# EAGLE design uTrakHF (EAGLE 7.7.0)
uTrak Balloon Tracker Version 1.0

## Sheet 1 of 2
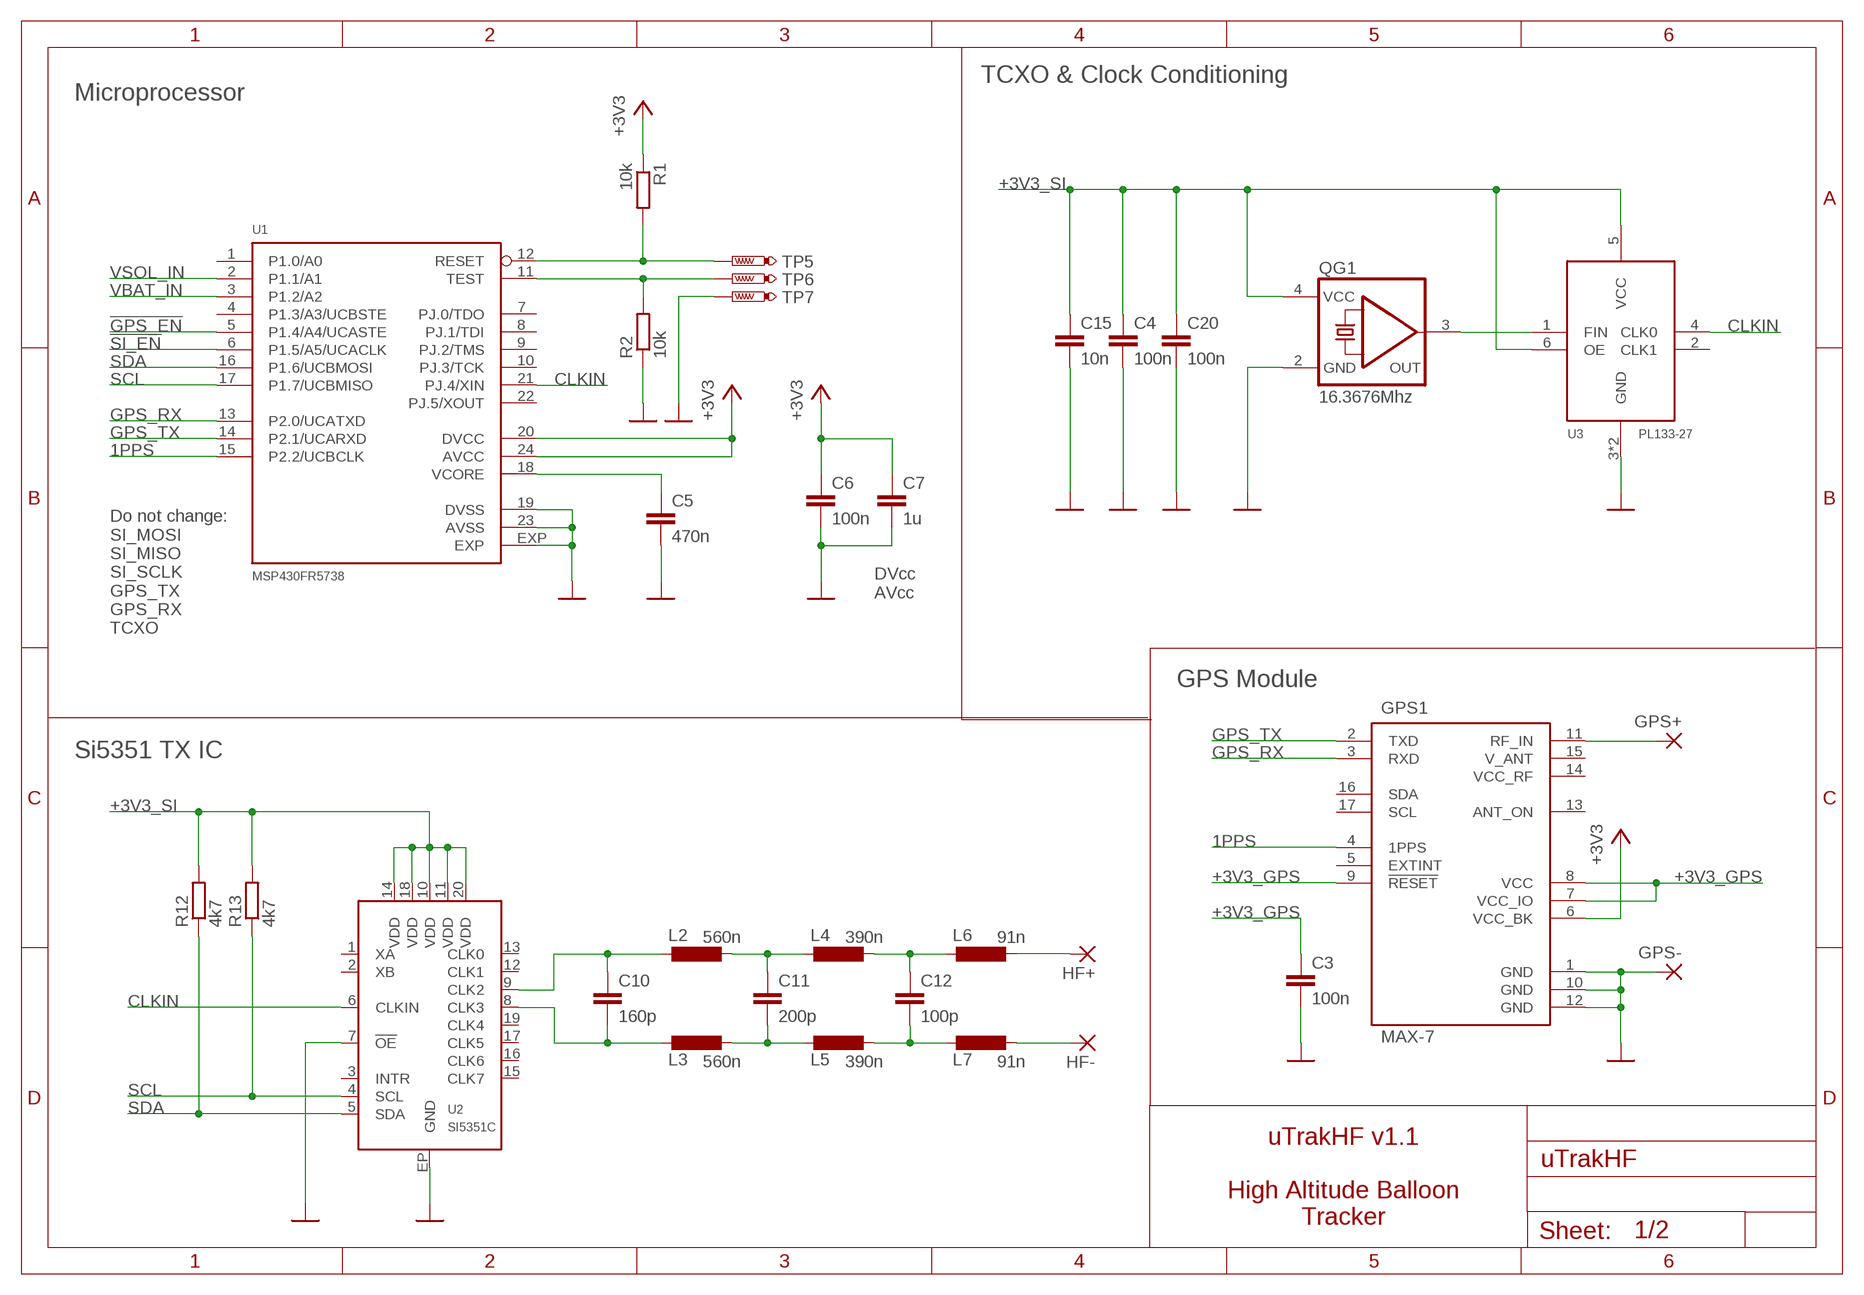
[diagram p0: schematic, sheet 1]

### Parts
C3  100n  C-EUC0402  [C0402]
C4  100n  C-EUC0402  [C0402]
C5  470n  C-EUC0603  [C0603]
C6  100n  C-EUC0402  [C0402]
C7  1u  C-EUC0603  [C0603]
C10  160p  C-EUC0402  [C0402]
C11  200p  C-EUC0402  [C0402]
C12  100p  C-EUC0402  [C0402]
C15  10n  C-EUC0402  [C0402]
C20  100n  C-EUC0402  [C0402]
GPS1  MAX-7  [UBLOX-7]
GPS+  SMD2  [SMD1,27-2,54]
GPS-  SMD2  [SMD1,27-2,54]
HF+  SMD2  [SMD1,27-2,54]
HF-  SMD2  [SMD1,27-2,54]
L2  560n  L0603  [C0603]
L3  560n  L0603  [C0603]
L4  390n  L0603  [C0603]
L5  390n  L0603  [C0603]
L6  91n  L0603  [C0603]
L7  91n  L0603  [C0603]
QG1  16.3676Mhz  XO  [CTS406]
R1  10k  R-EU_R0402  [R0402]
R2  10k  R-EU_R0402  [R0402]
R12  4k7  R-EU_R0402  [R0402]
R13  4k7  R-EU_R0402  [R0402]
TP5  PTR1TP10SQ  [TP10SQ]
TP6  PTR1TP10SQ  [TP10SQ]
TP7  PTR1TP10SQ  [TP10SQ]
U1  MSP430FR5738  [QFN24-4X4]
U2  SI5351C  [QFN20-4X4]
U3  PL133-27  [DFN6-2X3]

### Nets
1PPS: GPS1.4(1PPS) U1.15(P2.2/UCBCLK)
!GPS_EN: U1.5(P1.4/A4/UCASTE) ; also sheet 2
!SI_EN: U1.6(P1.5/A5/UCACLK) ; also sheet 2
+3V3: C6.1 C7.1 GPS1.6(VCC_BK) R1.1 U1.20(DVCC) U1.24(AVCC) ; also sheet 2
+3V3_GPS: C3.1 GPS1.7(VCC_IO) GPS1.8(VCC) GPS1.9(!RESET) ; also sheet 2
+3V3_SI: C4.1 C15.1 C20.1 QG1.4(VCC) R12.2 R13.2 U2.10(VDD) U2.11(VDD) U2.14(VDD) U2.18(VDD) U2.20(VDD) U3.5(VCC) U3.6(OE) ; also sheet 2
C33: C10.1 L2.1 U2.9(CLK2)
CLKIN: U1.21(PJ.4/XIN) U2.6(CLKIN) U3.4(CLK0)
GND: C3.2 C4.2 C5.2 C6.2 C7.2 C15.2 C20.2 GPS1.1(GND) GPS1.10(GND) GPS1.12(GND) GPS-.1(P) QG1.2(GND) R2.1 TP7.TP U1.19(DVSS) U1.23(AVSS) U1.EXP U2.7(!OE) U2.EP(GND) U3.3(GND) U3.EXP(GND) ; also sheet 2
GPS+: GPS1.11(RF_IN) GPS+.1(P)
GPS_RX: GPS1.3(RXD) U1.13(P2.0/UCATXD)
GPS_TX: GPS1.2(TXD) U1.14(P2.1/UCARXD)
HF+: HF+.1(P) L6.2
HF-: HF-.1(P) L7.2
N$2: C5.1 U1.18(VCORE)
N$3: C11.1 L2.2 L4.1
N$5: C12.1 L4.2 L6.1
N$12: C10.2 L3.1 U2.8(CLK3)
N$15: C11.2 L3.2 L5.1
N$16: C12.2 L5.2 L7.1
RST: R1.2 TP5.TP U1.12(RESET)
SCL: R13.1 U1.17(P1.7/UCBMISO) U2.4(SCL)
SDA: R12.1 U1.16(P1.6/UCBMOSI) U2.5(SDA)
TCXO: QG1.3(OUT) U3.1(FIN)
TST: R2.2 TP6.TP U1.11(TEST)
VBAT_IN: U1.3(P1.2/A2) ; also sheet 2
VSOL_IN: U1.2(P1.1/A1) ; also sheet 2
Unconnected: GPS1.5(EXTINT) GPS1.13(ANT_ON) GPS1.14(VCC_RF) GPS1.15(V_ANT) GPS1.16(SDA) GPS1.17(SCL) U1.1(P1.0/A0) U1.4(P1.3/A3/UCBSTE) U1.7(PJ.0/TDO) U1.8(PJ.1/TDI) U1.9(PJ.2/TMS) U1.10(PJ.3/TCK) U1.22(PJ.5/XOUT) U2.1(XA) U2.2(XB) U2.3(INTR) U2.12(CLK1) U2.13(CLK0) U2.15(CLK7) U2.16(CLK6) U2.17(CLK5) U2.19(CLK4) U3.2(CLK1)

### Notes on the sheet
- TCXO & Clock Conditioning
- Microprocessor
- DVcc
  AVcc
- Do not change:
  SI_MOSI
  SI_MISO
  SI_SCLK
  GPS_TX
  GPS_RX
  TCXO
- GPS Module
- Si5351 TX IC
- uTrakHF v1.1
  
  High Altitude Balloon
  Tracker

## Sheet 2 of 2
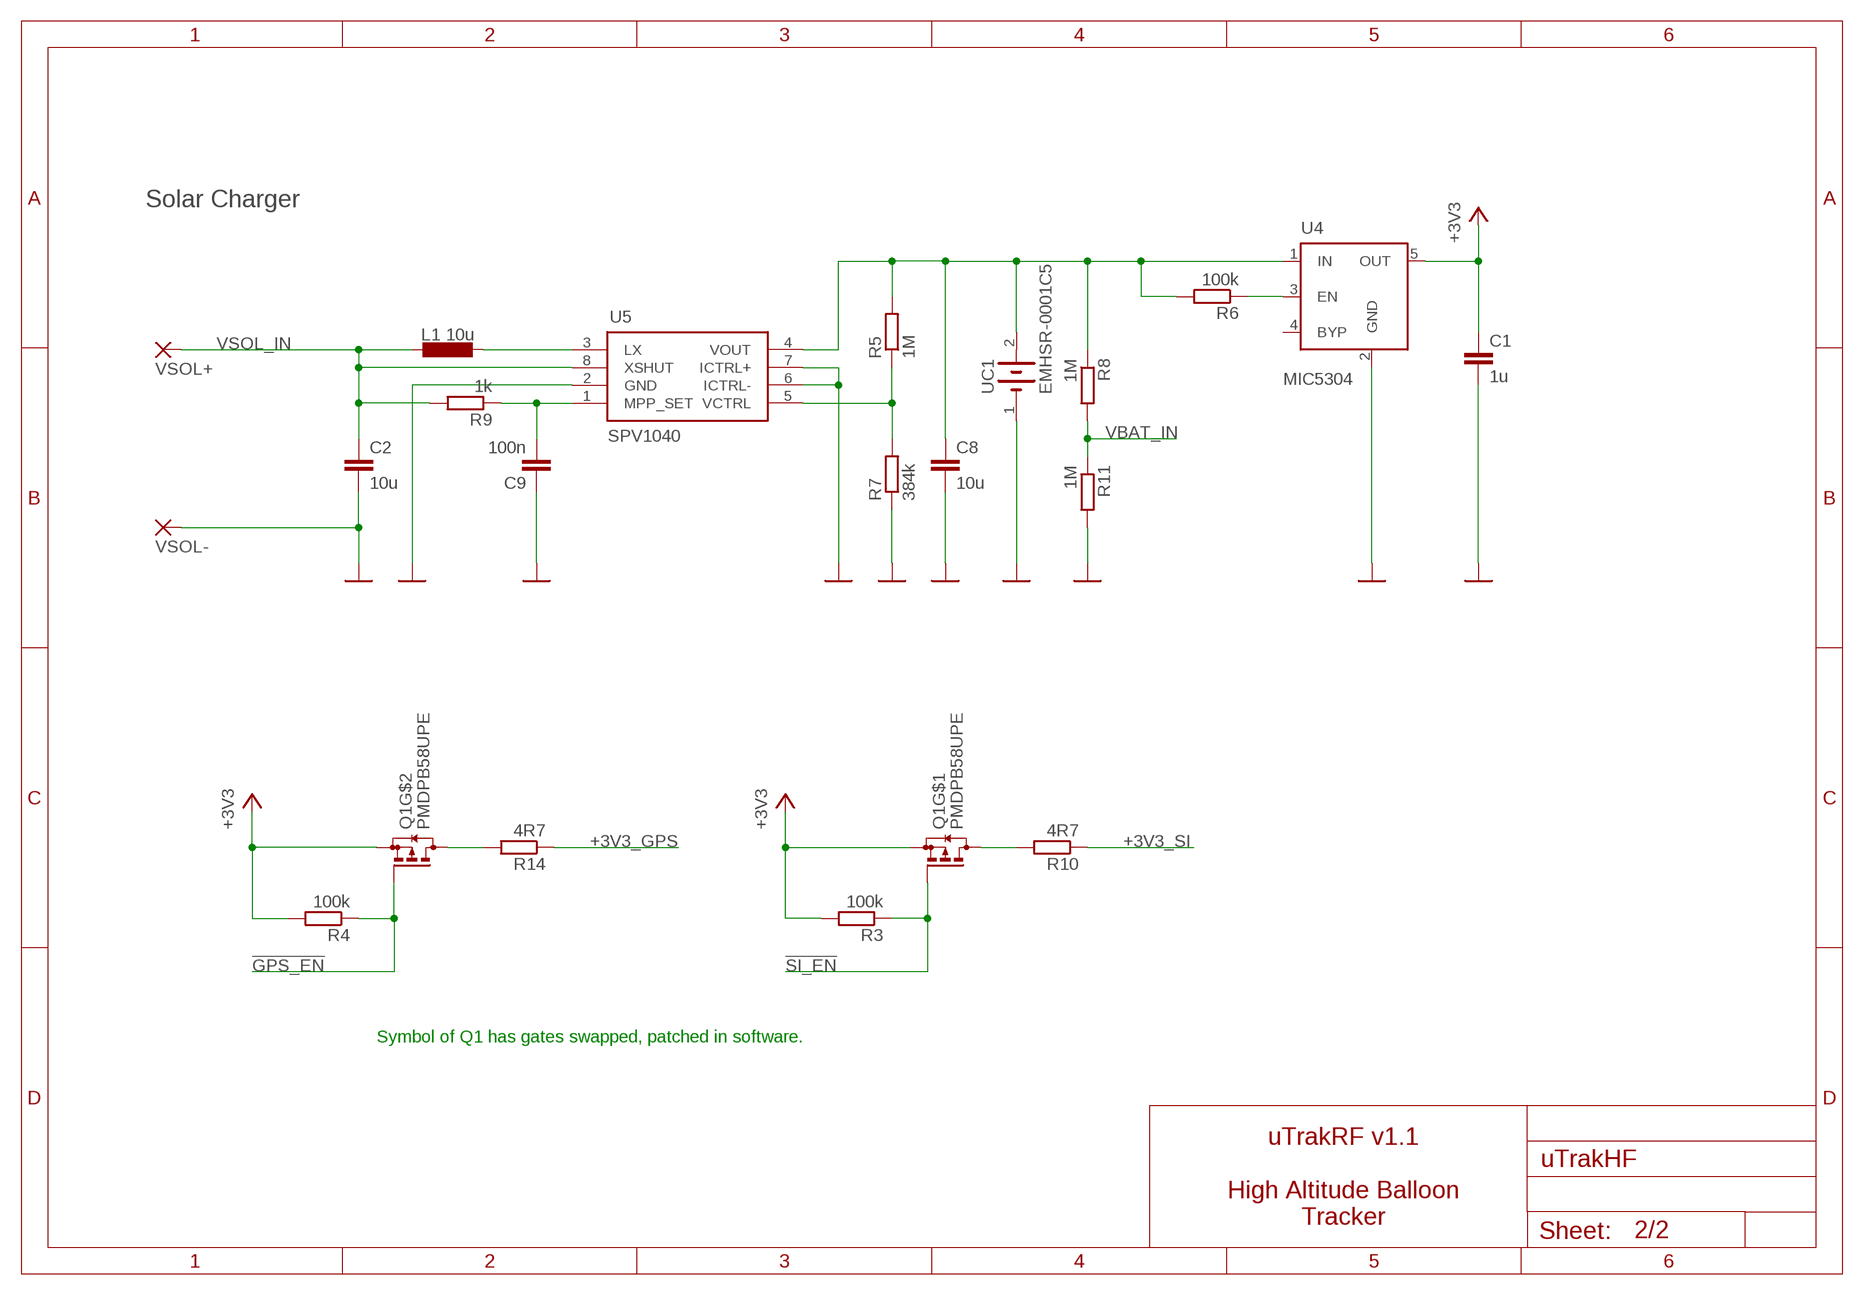
[diagram p1: schematic, sheet 2]

### Parts
C1  1u  C-EUC0603  [C0603]
C2  10u  C-EUC0603  [C0603]
C8  10u  C-EUC0603  [C0603]
C9  100n  C-EUC0402  [C0402]
L1  10u  LPS4018  [LPS4018]
Q1  PMDPB58UPE  [SOT1118]
R3  100k  R-EU_R0402  [R0402]
R4  100k  R-EU_R0402  [R0402]
R5  1M  R-EU_R0402  [R0402]
R6  100k  R-EU_R0402  [R0402]
R7  384k  R-EU_R0402  [R0402]
R8  1M  R-EU_R0402  [R0402]
R9  1k  R-EU_R0402  [R0402]
R10  4R7  R-EU_R0402  [R0402]
R11  1M  R-EU_R0402  [R0402]
R14  4R7  R-EU_R0402  [R0402]
U4  MIC5304  MIC5219XX  [SOT23-5]
U5  SPV1040  [TSSOP8]
UC1  EMHSR-0001C5  [EMHSR-0001C5-005R0]
VSOL+  SMD2  [SMD1,27-2,54]
VSOL-  SMD2  [SMD1,27-2,54]

### Nets
!GPS_EN: Q1.5(G) R4.1 ; also sheet 1
!SI_EN: Q1.2(G) R3.1 ; also sheet 1
+3V3: C1.1 Q1.1(S) Q1.4(S) R3.2 R4.2 U4.5(OUT) ; also sheet 1
+3V3_GPS: R14.1 ; also sheet 1
+3V3_SI: R10.1 ; also sheet 1
GND: C1.2 C2.2 C8.2 C9.1 R7.1 R11.2 U4.2(GND) U5.2(GND) U5.6(ICTRL-) U5.7(ICTRL+) UC1.1(-) VSOL-.1(P) ; also sheet 1
N$1: Q1.3(D) Q1.8(D) R10.2
N$4: Q1.6(D) Q1.7(D) R14.2
N$6: R6.1 U4.3(EN)
N$7: L1.1 U5.3(LX)
N$8: C9.2 R9.1 U5.1(MPP_SET)
N$20: R5.1 R7.2 U5.5(VCTRL)
VBAT: C8.1 R5.2 R6.2 R8.1 U4.1(IN) U5.4(VOUT) UC1.2(+)
VBAT_IN: R8.2 R11.1 ; also sheet 1
VSOL_IN: C2.1 L1.2 R9.2 U5.8(XSHUT) VSOL+.1(P) ; also sheet 1
Unconnected: U4.4(BYP)

### Notes on the sheet
- Solar Charger
- Symbol of Q1 has gates swapped, patched in software.
- uTrakRF v1.1
  
  High Altitude Balloon
  Tracker

## Library data of the parts
C1 C2 C8 C9 = rcl:C-EU: CAPACITOR, European symbol
C3 C4 C6 C20 = rcl:C-EU: CAPACITOR, European symbol; PARTNO: 81-GRM155R71C104KA88
C5 = rcl:C-EU: CAPACITOR, European symbol; PARTNO: 81-GCM188R71C474KA5D
C7 = rcl:C-EU: CAPACITOR, European symbol; PARTNO: 81-GRM39R105K10
C10 = rcl:C-EU: CAPACITOR, European symbol; PARTNO: 81-GRM1555C1H161JA01
C11 = rcl:C-EU: CAPACITOR, European symbol; PARTNO: 81-GRM1555C1H201JA1D
C12 = rcl:C-EU: CAPACITOR, European symbol; PARTNO: 81-GRM1555C1H101JA1D
C15 = rcl:C-EU: CAPACITOR, European symbol; PARTNO: 81-GRM155R71H103MA8D
GPS1 = ublox-gps:MAX-7
GPS+ GPS- HF+ HF- VSOL+ VSOL- = wirepad:SMD2: SMD PAD; BOM: EXCLUDE
L1 = coilcraft:LPS4018; PARTNO: 994-LPS4018-223MRB
L2 L3 = rclcustom:L0603; PARTNO: 810-MLJ1608WR56JT000
L4 L5 = rclcustom:L0603; PARTNO: 810-MLJ1608WR39JT000
L6 L7 = rclcustom:L0603; PARTNO: 81-LQW18AN91NG00D
Q1 = pmdpb58:PMDPB58UPE: P-CHANNEL MOS FET; PARTNO: 771-PMDPB58UPE,115
QG1 = RS92TCXO:XO: CRYSTAL
R1 R2 = rcl:R-EU_: RESISTOR, European symbol; PARTNO: 603-RC0402FR-0710KL
R3 R4 R10 R14 = rcl:R-EU_: RESISTOR, European symbol; PARTNO: 603-RC0402FR-07100KL
R5-R7 R9 = rcl:R-EU_: RESISTOR, European symbol
R8 R11 = rcl:R-EU_: RESISTOR, European symbol; PARTNO: 603-RC0402FR-071ML
R12 R13 = rcl:R-EU_: RESISTOR, European symbol; PARTNO: 603-RC0402FR-074K7L
TP5-TP7 = testpad:PTR1: TEST PIN; BOM: EXCLUDE
U1 = msp430-fr:MSP430FR5738: MSP430FR5738 16bit Mixed Signal Microcontroller; PARTNO: 595-SP430FR5738IRGER
U2 = Si5351:SI5351; PARTNO: 634-SI5351C-B-GM
U3 = pl133_27:PL133-27: PL133-27 Clock Buffer 1:2; PARTNO: 998-PL133-27GC-R
U4 = v-reg-micrel:MIC5219XX: VOLTAGE REGULATOR; OC_FARNELL: unknown; OC_NEWARK: unknown
U5 = spv1040:SPV1040
UC1 = nesscap:EMHSR-0001C5: NessCap UltraCap; PARTNO: 581-SCMR22C155MRBA0

## Board
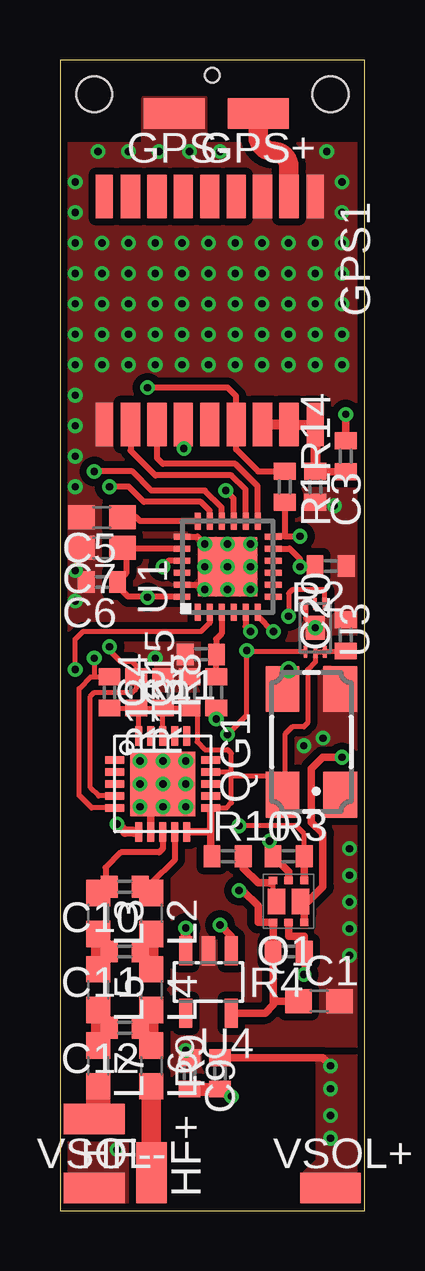
[diagram p2: board, top side]
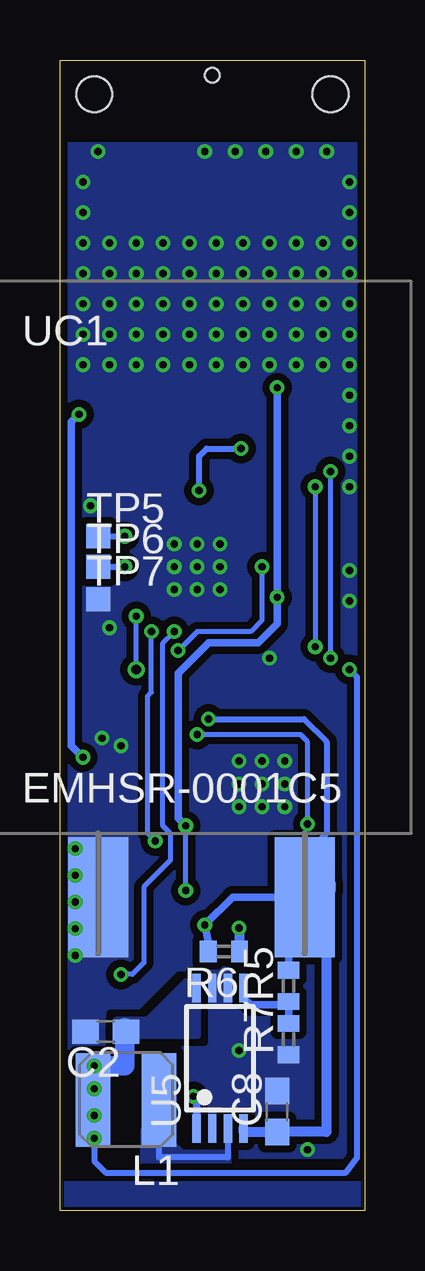
[diagram p3: board, bottom side, seen from below]

Size 12.7 x 47.94 mm. Coordinates in mm from the lower left corner, seen from the top.
Outline: 0,0 12.7,0 12.7,47.94 0,47.94 0,0
Copper layers (1*16): Top 0.035mm / dielectric 1.5mm / Bottom 0.035mm
Design rules "hackvana": minimum track width 6mil, minimum drill 0.3mm, track to track 6mil, track to pad 6mil, pad to pad 6mil, via to via 6mil, smd to smd 0mil, copper to edge 6mil, drill to drill 6mil, minimum pad ring 10mil, minimum via ring 6mil, stop-mask expansion 2mil, vias tented up to drill 100mil, thermal gap 10mil
Holes 1.5 mm at 1.43,46.51 11.27,46.51
Holes 0.6 mm at 6.35,47.31

### Footprints (pad centres in the part's own frame; a part is rotated, then mirrored left to right if it is on the bottom)
C0603 = smd 1.1 x 1: 1 -0.85,0; 2 0.85,0
C0402 = smd 0.7 x 0.9: 1 -0.65,0; 2 0.65,0
UBLOX-7 = smd 1.8 x 0.7: 1 4.838,-4.112; 9 4.838,4.688; 10 -4.662,4.688; 18 -4.662,-4.112 | smd 1.8 x 0.8: 2 4.838,-3.013; 3 4.838,-1.913; 4 4.838,-0.812; 5 4.838,0.287; 6 4.838,1.387; 7 4.838,2.487; 8 4.838,3.587; 11 -4.662,3.587; 12 -4.662,2.487; 13 -4.662,1.387; 14 -4.662,0.287; 15 -4.662,-0.812; 16 -4.662,-1.913; 17 -4.662,-3.013
SMD1,27-2,54 = smd 1.27 x 2.54: 1 0,0
LPS4018 = smd 1.448 x 3.886: 1 -1.422,0; 2 1.321,0
SOT1118 = smd 0.35 x 0.3: 1 -0.65,-0.9; 2 0,-0.9; 3 0.65,-0.9; 4 0.65,0.85; 5 0,0.85; 6 -0.65,0.85 | smd 0.72 x 1.05: 7 -0.5,-0.025; 8 0.5,-0.025
CTS406 = smd 1.9 x 1.4: 1 -2.2,-1.2; 2 2.2,-1.2; 3 2.2,1.2; 4 -2.2,1.2
R0402 = smd 0.7 x 0.9: 1 -0.65,0; 2 0.65,0
TP10SQ = smd 1 x 1: TP 0,0
QFN24-4X4 = smd 0.7 x 0.25: 1 -1.9,1.25; 2 -1.9,0.75; 3 -1.9,0.25; 4 -1.9,-0.25; 5 -1.9,-0.75; 6 -1.9,-1.25; 13 1.9,-1.25; 14 1.9,-0.75; 15 1.9,-0.25; 16 1.9,0.25; 17 1.9,0.75; 18 1.9,1.25 | smd 0.25 x 0.7: 7 -1.25,-1.9; 8 -0.75,-1.9; 9 -0.25,-1.9; 10 0.25,-1.9; 11 0.75,-1.9; 12 1.25,-1.9; 19 1.25,1.9; 20 0.75,1.9; 21 0.25,1.9; 22 -0.25,1.9; 23 -0.75,1.9; 24 -1.25,1.9 | smd 2.45 x 2.45: EXP 0,0
QFN20-4X4 = smd 0.8 x 0.3: 1 -2,1; 2 -2,0.5; 3 -2,0; 4 -2,-0.5; 5 -2,-1; 11 2,-1; 12 2,-0.5; 13 2,0; 14 2,0.5; 15 2,1 | smd 0.3 x 0.8: 6 -1,-2; 7 -0.5,-2; 8 0,-2; 9 0.5,-2; 10 1,-2; 16 1,2; 17 0.5,2; 18 0,2; 19 -0.5,2; 20 -1,2 | smd 2.7 x 2.7: EP 0,0
DFN6-2X3 = smd 0.5 x 0.2: 1 -1,0.39; 2 -1,-0.01; 3 -1,-0.4; 4 1,-0.405; 5 1,0.005; 6 1,0.395 | smd 1 x 0.8: EXP 0,0
SOT23-5 = smd 0.55 x 1.2: 1 -0.95,-1.3; 2 0,-1.3; 3 0.95,-1.3; 4 0.95,1.3; 5 -0.95,1.3
TSSOP8 = smd 1.2 x 0.35: 1 -2.925,0.975; 2 -2.925,0.325; 3 -2.925,-0.325; 4 -2.925,-0.975; 5 2.925,-0.975; 6 2.925,-0.325; 7 2.925,0.325; 8 2.925,0.975
EMHSR-0001C5-005R0 = smd 2.5 x 5: 1 -4.44,-11.54; 2 4.16,-11.54

### Placement (x,y rotation side)
C1  10.79,8.73 0 top
C2  10.79,7.46 180 bottom
C3  10.64,30.16 270 top
C4  4.29,21.59 90 top
C5  1.75,28.89 180 top
C6  1.75,26.19 180 top
C7  1.75,27.62 180 top
C8  3.65,4.13 90 bottom
C9  5.4,5.71 270 top
C10  2.7,13.49 180 top
C11  2.7,10.79 180 top
C12  2.7,7.62 180 top
C15  5.4,21.59 90 top
C20  11.91,23.97 90 top
GPS1  5.95,37.59 270 top
GPS+  8.26,45.72 90 top
GPS-  4.76,45.72 90 top
HF+  3.81,1.59 180 top
HF-  1.43,3.81 90 top
L1  10,4.6 180 bottom
L2  3.81,12.38 270 top
L3  1.59,12.38 270 top
L4  3.81,9.21 270 top
L5  1.59,9.21 270 top
L6  3.81,6.03 270 top
L7  1.59,6.03 270 top
Q1  9.53,12.86 180 top
QG1  10.48,19.53 90 top
R1  9.37,30.16 270 top
R2  11.27,26.86 180 top
R3  9.53,14.76 0 top
R4  9.53,10.79 180 top
R5  3.17,9.37 90 bottom
R6  5.87,10.79 180 bottom
R7  3.17,7.14 90 bottom
R8  6.51,21.59 90 top
R9  6.67,5.71 90 top
R10  6.99,14.76 0 top
R11  5.87,23.18 180 top
R12  2.06,21.59 270 top
R13  3.17,21.59 270 top
R14  11.91,31.43 90 top
TP5  11.11,28.1 0 bottom
TP6  11.11,26.83 0 bottom
TP7  11.11,25.48 0 bottom
U1  6.99,26.83 90 top
U2  4.29,17.78 0 top
U3  10.64,24.29 270 top
U4  6.19,9.53 180 top
U5  6.03,6.35 90 bottom
UC1  6.67,24.61 0 bottom
VSOL+  11.27,0.95 270 top
VSOL-  1.43,0.95 270 top

### Tracks (layer width: path | path; a pad name or v marks a point on that pad's centre or on a via)
1PPS  (via drill 0.3)
  Top 0.254: GPS1.4 5.14,31.81 v5.16,31.75 | U1.15 7.24,29.67 v6.91,30
  Bottom 0.254: v6.91,30 6.91,31.43 6.59,31.75 v5.16,31.75
!GPS_EN  (via drill 0.3)
  Top 0.203: v10.16,9.84 10.18,9.84 R4.1
  Top 0.254: U1.5 7.74,24.33 v7.94,24.13
  Top 0.305: Q1.5 9.53,11.43 10.18,11.43 R4.1
  Bottom 0.203: v10.16,9.84 9.68,9.84 9.21,10.32 9.21,13.49 8.1,14.61 8.1,15.72 8.41,16.03 8.41,23.65 v7.94,24.13
!SI_EN  (via drill 0.3)
  Top 0.203: 8.73,14.59 R3.1 | R3.1 | v8.73,15.4 8.73,14.91 R3.1 | 9.21,14.45 9.19,14.45
  Top 0.254: 9.19,14.45 R3.1 | U1.6 8.23,24.79 v8.89,24.13
  Top 0.305: Q1.2 9.53,14.13 9.21,14.45
  Bottom 0.203: v8.73,15.4 9.05,15.72 9.05,21.43 8.89,21.59 v8.89,24.13
+3V3  (via drill 0.3)
  Top 0.203: R3.2 10.18,15.7 9.84,16.03 v7.46,16.03
  Top 0.254: 2.54,27.62 C7.1 2.8,27.58 U1.20 2.75,27.58 2.75,26.55 C6.1 2.4,26.02 2.84,25.58 3.49,25.58 | v3.65,34.29 6.99,34.29 7.34,33.94 GPS1.6 7.34,31.71 8.26,30.8 9.35,30.8 R1.1 | U1.24 3.49,25.58 | v3.65,25.56 3.47,25.56 3.49,25.58
  Top 0.305: R3.2 Q1.1 | R4.2 Q1.4 8.26,12.01 8.26,12.7 7.62,13.34 v7.46,13.34 | U4.5 8.54,8.22 8.89,8.57 8.89,8.89 | 8.89,8.89 R4.2 | C1.1 9.05,8.73 8.89,8.89
  Top 0.406: R4.2
  Bottom 0.203: v7.46,13.34 v7.46,16.03
  Bottom 0.305: v3.65,34.29 v3.65,25.56 3.65,24.45 4.45,23.65 6.51,23.65 7.78,22.38 7.78,16.35 v7.46,16.03 7.46,16.19
+3V3_GPS
  Top 0.203: 10.69,32.7 GPS1.9 | C3.1 10.64,31.09
  Top 0.305: R14.1 10.67,30.78 C3.1
  Top 0.406: GPS1.7 GPS1.8 GPS1.9 10.64,31.09
+3V3_SI
  Top 0.203: C15.1 C4.1 | U2.18 C4.1 | U2.11 6.94,16.78 7.14,16.99 7.14,18.1 | 7.14,18.1 7.14,18.28 | 5.73,20.95 C15.1 | U2.14 7.14,18.28 | 7.14,18.28 7.14,19.05 6.99,19.21 6.03,19.21 5.71,19.53 5.71,20.8 5.57,20.94 C15.1 | 8.88,16.61 QG1.4 | QG1.4 9.37,17.33 | 9.37,17.33 9.37,18.1 | 9.37,18.1 9.37,19.84 9.68,20.16 10.16,20.16 10.32,20.32 10.32,22.54 10.64,22.86 U3.5 U3.6 11.91,23.29 C20.1 | 9.37,17.33 9.37,17.1 QG1.4 | R12.2 R13.2 3.29,20.94 | U2.20 3.29,20.94 | 3.29,20.94 C4.1 | 9.37,18.1 7.14,18.1
  Top 0.305: U2.11 6.29,15.88 | 6.29,15.88 6.29,14.97 R10.1 | U2.10 6.19,15.78 6.29,15.88
C33
  Top 0.203: 3.81,13.35 L2.1 3.61,13.23 C10.1
  Top 0.254: U2.9 4.79,14.63 3.81,13.65 L2.1
CLKIN  (via drill 0.3)
  Top 0.203: U3.4 7.83,23.29 v7.78,23.34 7.78,20.64 v6.99,19.84 | U2.6 3.08,15.78
  Top 0.254: U1.21 4.54,27.08 v4.29,26.83
  Top 0.406: 3.08,15.78 2.71,15.78 v2.38,16.11
  Bottom 0.203: v6.99,19.84 2.7,19.84 2.38,19.53 v2.38,16.11 | v4.29,26.83 4.29,24.61 4.76,24.13 6.99,24.13 v7.78,23.34
GND  (via drill 0.3)
  Top 0.203: U3.3 10.24,24.69 U3.EXP
  Top 0.254: U1.19 5.74,28.08 v6.03,27.78 | U1.23 5.83,26.08 v6.03,25.88
  Top 0.305: U2.7 3.79,17.12 3.81,17.14 3.81,17.3 U2.EP
  other vias: 6.99,27.78 6.03,26.83 6.99,25.88 6.99,26.83 7.94,27.78 7.94,26.83 7.94,25.88 5.4,44.13 11.11,44.13 11.75,42.86 11.75,41.59 11.75,40.32 11.75,39.05 11.75,37.78 11.75,36.51 11.75,35.24 0.64,33.97 0.64,35.24 0.64,36.51 0.64,37.78 0.64,39.05 0.64,40.32 0.64,41.59 0.64,42.86 1.59,44.13 2.86,44.13 4.13,44.13 6.67,44.13 3.33,18.73 5.24,18.73 4.29,18.73 3.33,16.83 3.33,17.78 4.29,16.83 5.24,16.83 5.24,17.78 4.29,17.78 10.64,24.29 10.95,19.68 3.97,23.02 11.43,29.37 1.75,35.24 1.75,40.32 1.75,39.05 1.75,37.78 1.75,36.51 2.86,36.51 3.97,36.51 5.08,36.51 6.19,36.51 7.3,36.51 8.41,36.51 9.53,36.51 10.64,36.51 9.53,35.24 10.64,35.24 7.3,35.24 8.41,35.24 5.08,35.24 6.19,35.24 2.86,35.24 3.97,35.24 2.86,37.78 3.97,37.78 5.08,37.78 6.19,37.78 7.3,37.78 8.41,37.78 9.53,37.78 10.64,37.78 9.53,39.05 10.64,39.05 9.53,40.32 10.64,40.32 7.3,40.32 8.41,40.32 7.3,39.05 8.41,39.05 5.08,40.32 6.19,40.32 2.86,40.32 3.97,40.32 2.86,39.05 3.97,39.05 5.08,39.05 6.19,39.05 0.64,32.7 0.64,31.43 0.64,30.16 0.64,25.4 0.64,26.67 12.06,10.64 12.06,11.75 12.06,12.86 12.06,13.97 12.06,15.08 10.16,19.37 5.24,6.67 2.38,2.54
  pour Top (isolate 0.305, rank 2, no thermals): 0,0 12.7,0 12.7,44.45 0,44.45
  pour Bottom (isolate 0.305, rank 2, no thermals): 0,2.22 12.7,2.22 12.7,44.45 0,44.45
  pour Top (no thermals): 3.49,46.35 6.03,46.35 6.03,43.81 3.49,43.81
GPS+
  Top 0.813: GPS1.11 9.54,43.48 arc90 8.89,44.13 arc-90 8.26,44.77 GPS+.1
GPS_RX
  Top 0.254: GPS1.3 4.04,31.36 4.29,31.11 7.3,31.11 8.23,30.18 U1.13
GPS_TX
  Top 0.254: U1.14 7.74,30.05 7.14,30.64 3.97,30.64 2.94,31.67 GPS1.2
HF+
  Top 0.61: 3.69,5.38 L6.2
  Top 0.813: L6.2 HF+.1
HF-
  Top 0.61: 2.38,3.81 HF-.1
  Top 1.016: L7.2 1.59,3.97 HF-.1
N$1
  Top 0.203: Q1.8 8.88,12.57 Q1.3
  Top 0.305: 8.75,13.64 Q1.3 8.77,13.65 8.26,13.65 7.63,14.27 R10.2
N$2
  Top 0.254: U1.18 3.34,28.73 3.17,28.89 C5.1
N$3
  Top 0.406: L4.1 3.95,10.06 | C11.1 3.81,10.79
  Top 0.61: L4.1 3.81,10.79 L2.2 3.69,11.73
N$4  (via drill 0.3)
  Top 0.203: Q1.7 10.05,12.54
  Top 0.305: Q1.7 10.34,12.88 10.95,13.49 10.95,15.72 10.48,16.19 10.48,18.41 10.95,18.89 v11.75,18.89 | v11.91,33.18 R14.2 | 10.05,12.54 10.18,12.54 Q1.6
  Bottom 0.305: v11.75,18.89 12.22,19.37 12.22,32.86 v11.91,33.18
N$5
  Top 0.406: L4.2 3.95,8.36 | C12.1 3.81,7.62
  Top 0.61: L6.1 3.81,7.62 L4.2 3.69,8.56
N$6  (via drill 0.3)
  Top 0.406: U4.3 v5.24,11.78
  Bottom 0.406: v5.24,11.78 R6.1
N$7
  Bottom 0.254: U5.3 5.71,2.23 5.71,2.22 8.57,2.22 L1.1
  pour Bottom (isolate 0.254, no thermals): 9.21,1.91 9.21,3.33 8.1,3.33 8.1,2.86 7.62,2.38 5.71,2.38 5.71,1.91
N$8  (via drill 0.3)
  Top 0.305: v7.14,4.76 6.97,4.76 R9.1
  Top 0.533: C9.2 R9.1
  Bottom 0.305: U5.1 7.01,4.63 v7.14,4.76
N$12
  Top 0.203: 1.6,13.25 L3.1
  Top 0.254: U2.8 4.29,15.08 4.13,14.92 2.54,14.92 1.91,14.29 1.91,13.64 C10.2
  Top 0.406: 1.6,13.25 2.05,13.25 C10.2
N$15
  Top 0.406: L3.2 1.6,11.53 | C11.2 1.59,10.79
  Top 0.61: L3.2 1.59,10.79 L5.1
N$16
  Top 0.406: L5.2 1.6,8.36 | C12.2 1.59,7.62
  Top 0.61: L7.1 1.59,7.62 L5.2
N$20
  Bottom 0.305: U5.5 5.06,8.87 4.76,8.57 3.32,8.57 R5.1 R7.2
RST  (via drill 0.3)
  Top 0.254: 8.88,28.09 U1.12 8.9,28.1 9.37,28.1 | R1.2 9.37,28.1 | 9.37,28.1 v10,28.1
  Bottom 0.254: TP5.TP v10,28.1
SCL  (via drill 0.3)
  Top 0.203: U2.4 1.61,17.28 1.27,17.62 1.27,21.43 1.43,21.59 3.02,21.59 3.17,21.75 R13.1 3.17,22.7 3.02,22.86 2.54,22.86 2.06,23.34 v2.06,23.5
  Top 0.254: U1.17 6.24,29.17 5.87,29.53 3.49,29.53 2.86,30.16 v2.06,30.16
  Bottom 0.203: v2.06,30.16 v2.06,23.5
SDA  (via drill 0.3)
  Top 0.203: 1.28,22.24 0.79,21.75 0.79,17.3 1.32,16.78 U2.5 | 1.27,22.24 1.28,22.24 | 1.28,22.24 R12.1 1.43,22.24 v1.43,23.02
  Top 0.254: U1.16 6.74,29.3 6.03,30 3.81,30 3.02,30.8 v1.43,30.8
  Bottom 0.203: v1.43,23.02 v1.43,30.8
TCXO  (via drill 0.3, 0.41)
  Top 0.203: U3.1 11.03,25.8 10.95,25.88 9.68,25.88 9.53,25.72 v9.53,24.77 | QG1.3 9.28,21.98 v9.53,22.54
  Bottom 0.203: v9.53,22.54 v9.53,24.77
TST  (via drill 0.3)
  Top 0.254: U1.11 9.57,27.58 10,27.15 v10,26.83 10.62,26.83 R2.2
  Bottom 0.254: TP6.TP v10,26.83
VBAT  (via drill 0.3)
  Top 0.254: R8.1 v6.51,20.48
  Top 0.305: U4.1 7.14,11.43 v6.67,11.91
  Bottom 0.254: v6.51,20.48 2.54,20.48 1.59,19.53 1.59,15.72 2.06,15.24
  Bottom 0.305: 1.43,13.34 1.43,12.94 | R6.2 6.51,11.13 v6.67,11.91 5.51,13.07 UC1.2 3.17,12.4 R5.2
  Bottom 0.406: U5.4 5.06,3.28 C8.1 1.59,3.28 1.59,13.65 | 1.59,13.65 2.06,13.65 | 2.06,13.65 2.06,15.24 | 1.59,13.65 1.43,13.65 1.43,13.34 | 2.06,13.65 2.51,13.65 UC1.2
VBAT_IN
  Top 0.203: 6.74,23.39 R11.1 6.51,23.19
  Top 0.254: R8.2 6.51,23.03 R11.1 | U1.3 6.74,24.04 6.51,23.81 6.51,23.19
VSOL_IN  (via drill 0.3)
  Top 0.203: 6.24,24.49 5.87,24.13 0.95,24.13 0.64,23.81 v0.64,22.54
  Top 0.254: U1.2 6.24,24.49
  Top 0.305: R9.2 10.94,6.37 v11.27,6.03
  Bottom 0.254: v0.64,22.54 0.32,22.23 0.32,2.22 0.79,1.59 10.79,1.59 11.27,2.06 v11.27,3.02
  Bottom 0.305: v11.27,5.08 11.27,4.66 L1.2
  Bottom 0.813: v11.27,6.03 10,6.03 10,7.62 C2.1
  other vias: 11.27,3.97
  pour Top (isolate 0.305, no thermals): 10.16,0.48 10.16,1.43 10.79,2.06 10.79,2.54 10.79,6.35 12.38,6.35 12.38,0.48
  pour Bottom (isolate 0.305, no thermals): 6.99,9.53 6.99,7.3 10.32,7.3 10.32,7.94 9.05,7.94 7.46,9.53
VSOL_MID
  pour Bottom: 0,1.11 12.7,1.11 12.7,0 0,0

### Text on the board
bStefan: uTrakHF GPS Tracker v1.1 / High altitude balloon payload / / www.loetlabor-jena.de